# EAGLE design gl-main (EAGLE 6.4)
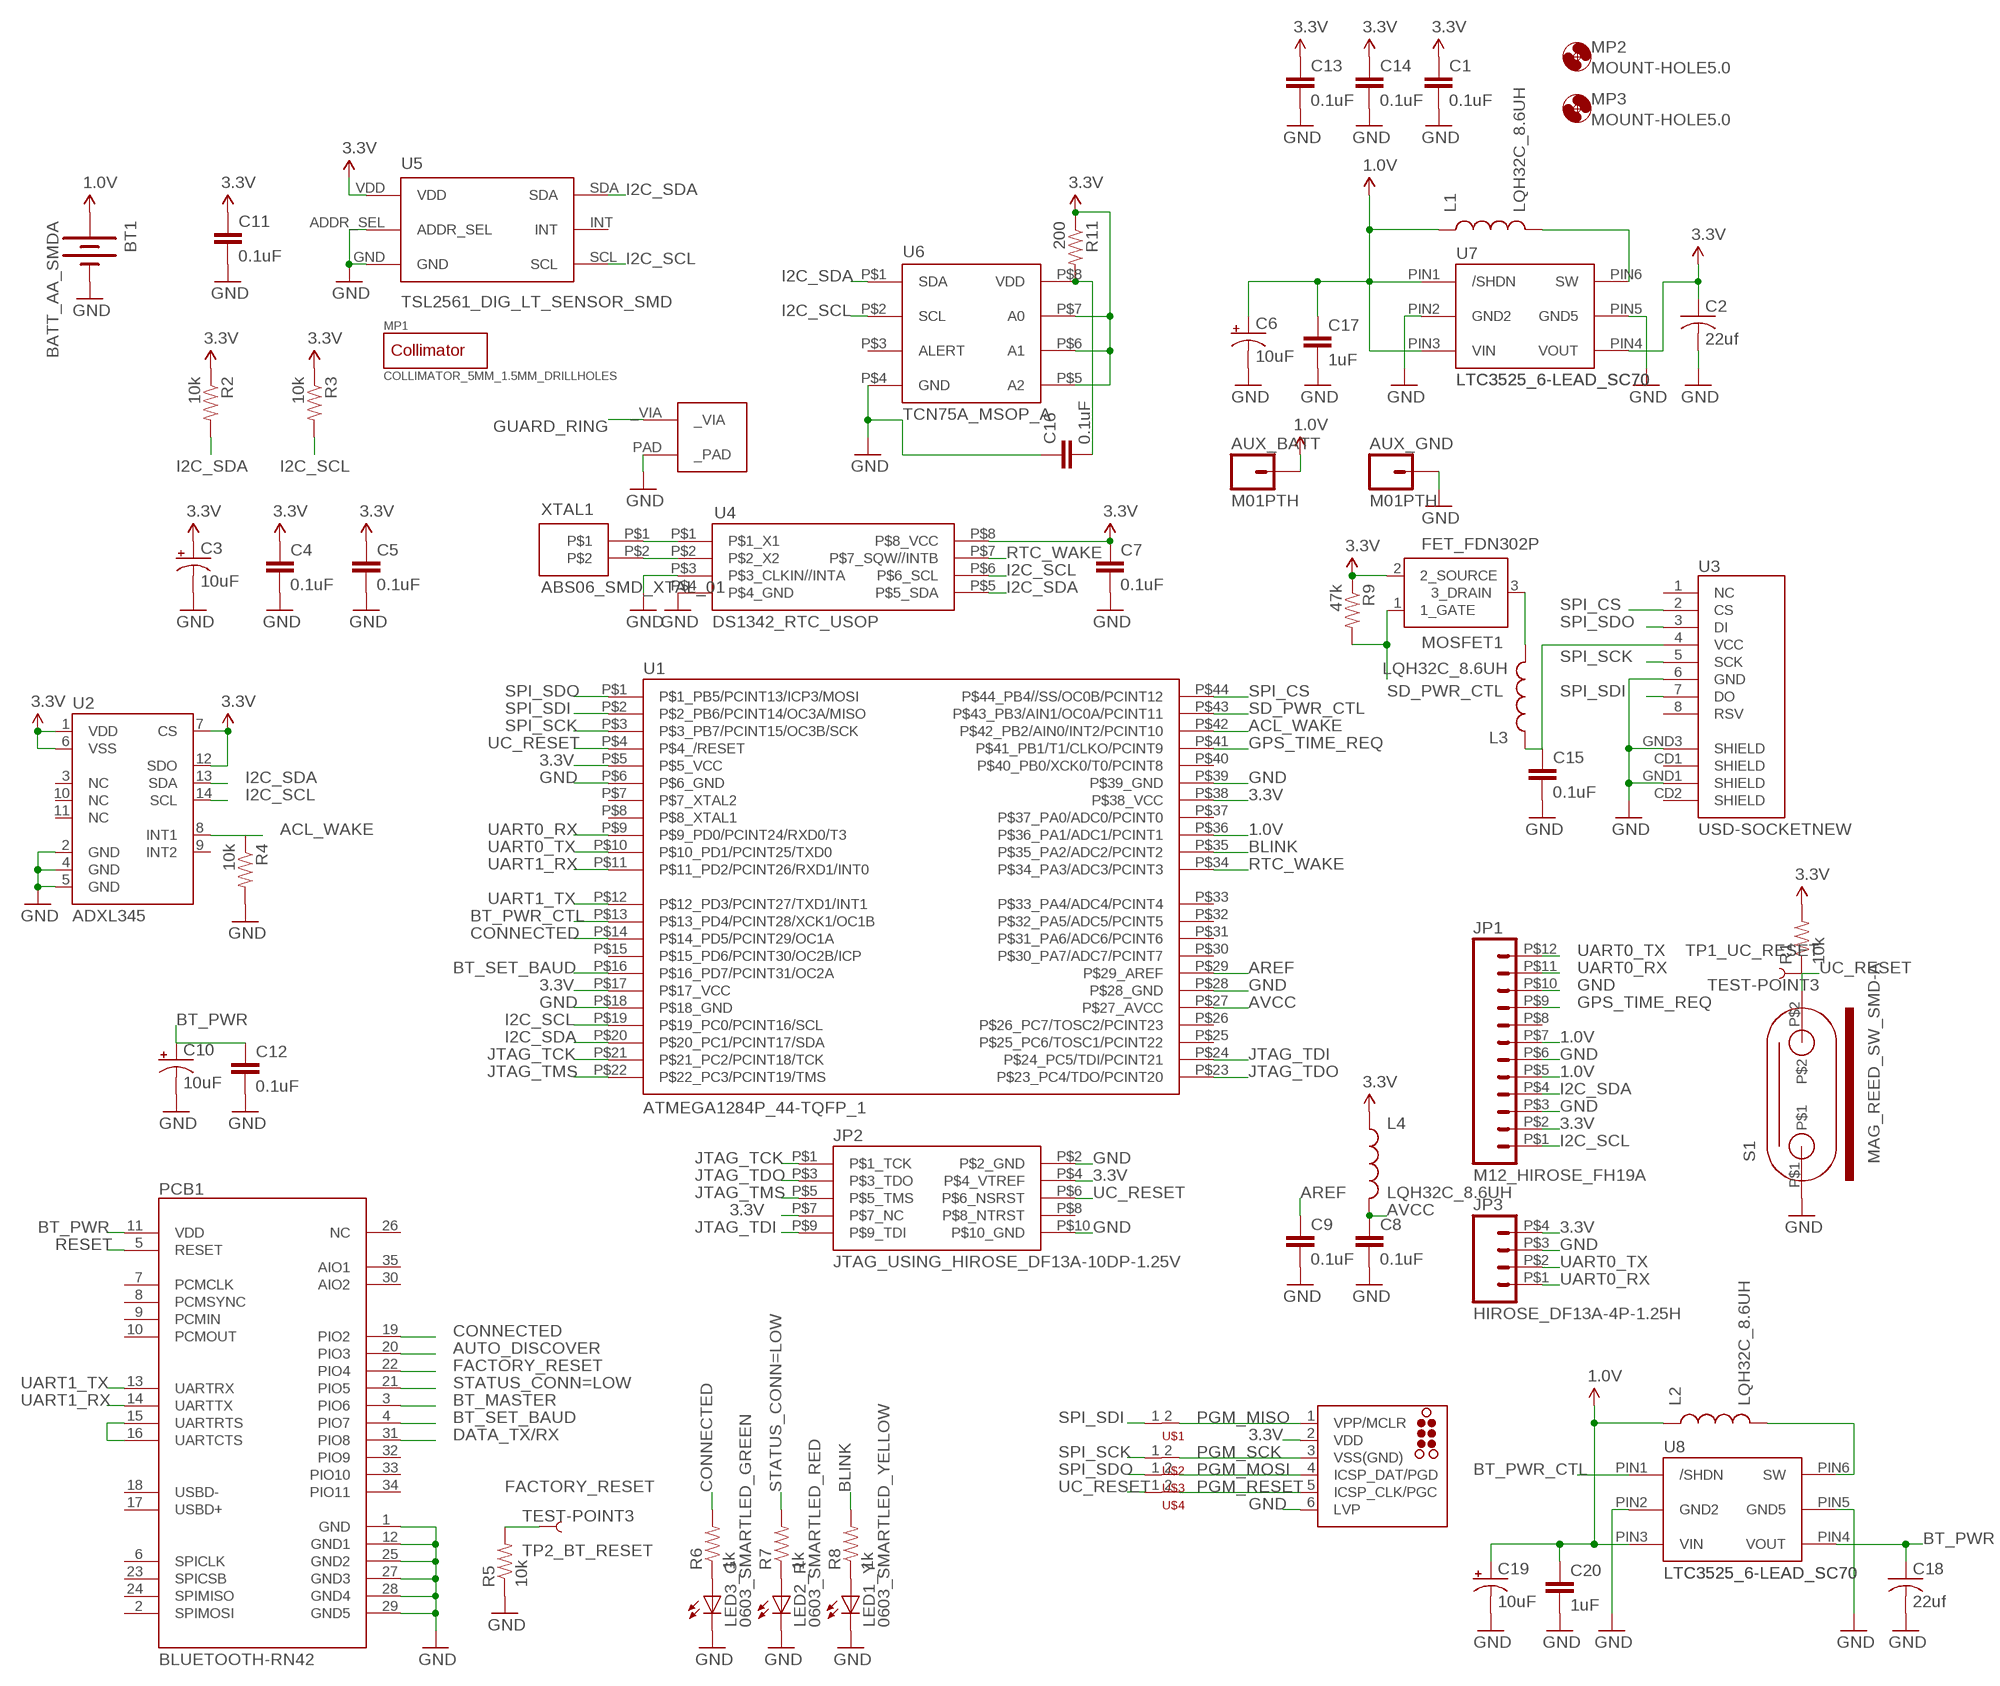
[diagram p0: schematic, sheet 1]

## Parts
AUX_BATT  M01PTH  [1X01]
AUX_GND  M01PTH  [1X01]
BT1  BATT_AA_SMDA  [BATT_AA_SMD]
C1  0.1uF  CAP0402-CAP  [0402-CAP]
C2  22uf  C-USC1210K  [C1210K]
C3  10uF  CAP_POL1206  [EIA3216]
C4  0.1uF  CAP0402-CAP  [0402-CAP]
C5  0.1uF  CAP0402-CAP  [0402-CAP]
C6  10uF  CAP_POL1206  [EIA3216]
C7  0.1uF  CAP0402-CAP  [0402-CAP]
C8  0.1uF  CAP0402-CAP  [0402-CAP]
C9  0.1uF  CAP0402-CAP  [0402-CAP]
C10  10uF  CAP_POL1206  [EIA3216]
C11  0.1uF  CAP0402-CAP  [0402-CAP]
C12  0.1uF  CAP0402-CAP  [0402-CAP]
C13  0.1uF  CAP0402-CAP  [0402-CAP]
C14  0.1uF  CAP0402-CAP  [0402-CAP]
C15  0.1uF  CAP0402-CAP  [0402-CAP]
C16  0.1uF  CAP0402-CAP  [0402-CAP]
C17  1uF  CAP0603-CAP  [0603-CAP]
C18  22uf  C-USC1210K  [C1210K]
C19  10uF  CAP_POL1206  [EIA3216]
C20  1uF  CAP0603-CAP  [0603-CAP]
J1  TC2030-MCP-NL  [TC2030-MCP-NL]
JP1  M12_HIROSE_FH19A  [HIROSE_FH19_12POS]
JP2  JTAG_USING_HIROSE_DF13A-10DP-1.25V  [10PIN_MALE_HDR_DBL-ROW_HIROSE_D13]
JP3  HIROSE_DF13A-4P-1.25H  [HIROSE_DF13A-4P-1.25H]
L1  LQH32C_8.6UH  LQH32C  [1210_SIZE_INDUCTOR]
L2  LQH32C_8.6UH  LQH32C  [1210_SIZE_INDUCTOR]
L3  LQH32C_8.6UH  LQH32C  [1210_SIZE_INDUCTOR]
L4  LQH32C_8.6UH  LQH32C  [1210_SIZE_INDUCTOR]
LED1_Y  0603_SMARTLED_YELLOW  0603_SMARTLED  [0603_SMARTLED]
LED2_R  0603_SMARTLED_RED  0603_SMARTLED  [0603_SMARTLED]
LED3_G  0603_SMARTLED_GREEN  0603_SMARTLED  [0603_SMARTLED]
MOSFET1  FET_FDN302P  [SUPERSOT-3]
MP1  COLLIMATOR_5MM_1.5MM_DRILLHOLES  [COLLIMATOR_5MM_1.5MM_DRILLHOLES]
MP2  MOUNT-HOLE5.0  [5,0]
MP3  MOUNT-HOLE5.0  [5,0]
PCB1  BLUETOOTH-RN42  BLUETOOTH-RN41"  [RN41]
R1  10k  RESISTOR0402-RES  [0402-RES]
R2  10k  RESISTOR0402-RES  [0402-RES]
R3  10k  RESISTOR0402-RES  [0402-RES]
R4  10k  RESISTOR0402-RES  [0402-RES]
R5  10k  RESISTOR0402-RES  [0402-RES]
R6  1k  RESISTOR0402-RES  [0402-RES]
R7  1k  RESISTOR0402-RES  [0402-RES]
R8  1k  RESISTOR0402-RES  [0402-RES]
R9  47k  RESISTOR0402-RES  [0402-RES]
R11  200  RESISTOR0402-RES  [0402-RES]
S1  MAG_REED_SW_SMD-A  [MAG_REED_SW_SMD_GULL-WING]
TP1_UC_RESET  TEST-POINT3  [PAD.03X.03]
TP2_BT_RESET  TEST-POINT3  [PAD.03X.03]
U1  ATMEGA1284P_44-TQFP_1  [44-TQFP]
U2  ADXL345  [LGA14]
U3  USD-SOCKETNEW  [MICRO-SD-SOCKET-PP]
U4  DS1342_RTC_USOP  [8-MICROMAX]
U5  TSL2561_DIG_LT_SENSOR_SMD  [6_PAD_FLAT_NO-LEAD]
U6  TCN75A_MSOP_A  [MSOP-8]
U7  LTC3525_6-LEAD_SC70  [SC70]
U8  LTC3525_6-LEAD_SC70  [SC70]
U$1  SHORT_8MIL8MIL  [SHORT_8MIL]
U$2  SHORT_8MIL8MIL  [SHORT_8MIL]
U$3  SHORT_8MIL8MIL  [SHORT_8MIL]
U$4  SHORT_8MIL8MIL  [SHORT_8MIL]
W1  2-SIGNAL_VIA_AND_PAD_01  [2_SIGNALS_VIA_AND_PAD]
XTAL1  ABS06_SMD_XTAL_01  [ABS06]

## Nets
1.0V: AUX_BATT.1 BT1.P$1(+) C6.A(+) C17.1 C19.A(+) C20.1 JP1.P$5 JP1.P$7 L1.P$1 L2.P$1 U1.P$36(P$36_PA1/ADC1/PCINT1) U7.PIN1(/SHDN) U7.PIN3(VIN) U8.PIN3(VIN)
3.3V: C1.1 C2.1 C3.A(+) C4.1 C5.1 C7.1 C11.1 C13.1 C14.1 J1.2(VDD) JP1.P$2 JP2.P$4(P$4_VTREF) JP2.P$7(P$7_NC) JP3.P$4 L4.P$1 MOSFET1.2(2_SOURCE) R1.2 R2.1 R3.1 R9.1 R11.1 U1.P$5(P$5_VCC) U1.P$17(P$17_VCC) U1.P$38(P$38_VCC) U2.1(VDD) U2.6(VSS) U2.7(CS) U2.12(SDO) U4.P$8(P$8_VCC) U5.VDD U6.P$5(A2) U6.P$6(A1) U6.P$7(A0) U7.PIN4(VOUT)
ACL_WAKE: R4.1 U1.P$42(P$42_PB2/AIN0/INT2/PCINT10) U2.8(INT1)
AREF: C9.1 U1.P$29(P$29_AREF)
AUTO_DISCOVER: PCB1.20(PIO3)
AVCC: C8.1 L4.P$2 U1.P$27(P$27_AVCC)
BLINK: R8.2 U1.P$35(P$35_PA2/ADC2/PCINT2)
BT_MASTER: PCB1.3(PIO6)
BT_PWR: C10.A(+) C12.1 C18.1 PCB1.11(VDD) U8.PIN4(VOUT)
BT_PWR_CTL: U1.P$13(P$13_PD4/PCINT28/XCK1/OC1B) U8.PIN1(/SHDN)
BT_SET_BAUD: PCB1.4(PIO7) U1.P$16(P$16_PD7/PCINT31/OC2A)
CONNECTED: PCB1.19(PIO2) R6.2 U1.P$14(P$14_PD5/PCINT29/OC1A)
DATA_TX/RX: PCB1.31(PIO8)
FACTORY_RESET: PCB1.22(PIO4) R5.2 TP2_BT_RESET.P$1
GND: AUX_GND.1 BT1.P$2(-) C1.2 C2.2 C3.C(-) C4.2 C5.2 C6.C(-) C7.2 C8.2 C9.2 C10.C(-) C11.2 C12.2 C13.2 C14.2 C15.2 C16.1 C17.2 C18.2 C19.C(-) C20.2 J1.6(LVP) JP1.P$3 JP1.P$6 JP1.P$10 JP2.P$2(P$2_GND) JP2.P$10(P$10_GND) JP3.P$3 LED1_Y.P$1(C) LED2_R.P$1(C) LED3_G.P$1(C) PCB1.1(GND) PCB1.12(GND1) PCB1.25(GND2) PCB1.27(GND3) PCB1.28(GND4) PCB1.29(GND5) R4.2 R5.1 S1.P$1 U1.P$6(P$6_GND) U1.P$18(P$18_GND) U1.P$28(P$28_GND) U1.P$39(P$39_GND) U2.2(GND) U2.4(GND) U2.5(GND) U3.6(GND) U3.GND1(SHIELD) U3.GND3(SHIELD) U4.P$3(P$3_CLKIN//INTA) U4.P$4(P$4_GND) U5.ADDR_SEL U5.GND U6.P$4(GND) U7.PIN2(GND2) U7.PIN5(GND5) U8.PIN2(GND2) U8.PIN5(GND5) W1.PAD(_PAD)
GPS_TIME_REQ: JP1.P$9 U1.P$41(P$41_PB1/T1/CLKO/PCINT9)
GUARD_RING: W1._VIA
I2C_SCL: JP1.P$1 R3.2 U1.P$19(P$19_PC0/PCINT16/SCL) U2.14(SCL) U4.P$6(P$6_SCL) U5.SCL U6.P$2(SCL)
I2C_SDA: JP1.P$4 R2.2 U1.P$20(P$20_PC1/PCINT17/SDA) U2.13(SDA) U4.P$5(P$5_SDA) U5.SDA U6.P$1(SDA)
JTAG_TCK: JP2.P$1(P$1_TCK) U1.P$21(P$21_PC2/PCINT18/TCK)
JTAG_TDI: JP2.P$9(P$9_TDI) U1.P$24(P$24_PC5/TDI/PCINT21)
JTAG_TDO: JP2.P$3(P$3_TDO) U1.P$23(P$23_PC4/TDO/PCINT20)
JTAG_TMS: JP2.P$5(P$5_TMS) U1.P$22(P$22_PC3/PCINT19/TMS)
N$1: LED1_Y.P$2(A) R8.1
N$2: L1.P$2 U7.PIN6(SW)
N$3: C15.1 L3.P$1 U3.4(VCC)
N$4: L3.P$2 MOSFET1.3(3_DRAIN)
N$5: PCB1.15(UARTRTS) PCB1.16(UARTCTS)
N$7: LED2_R.P$2(A) R7.1
N$8: LED3_G.P$2(A) R6.1
N$11: C16.2 R11.2 U6.P$8(VDD)
N$12: L2.P$2 U8.PIN6(SW)
N$13: U4.P$1(P$1_X1) XTAL1.P$1
N$14: U4.P$2(P$2_X2) XTAL1.P$2
PGM_MISO: J1.1(VPP/MCLR) U$1.2(P)
PGM_MOSI: J1.4(ICSP_DAT/PGD) U$3.2(P)
PGM_RESET: J1.5(ICSP_CLK/PGC) U$4.2(P)
PGM_SCK: J1.3(VSS(GND)) U$2.2(P)
RESET: PCB1.5(RESET)
RTC_WAKE: U1.P$34(P$34_PA3/ADC3/PCINT3) U4.P$7(P$7_SQW//INTB)
SD_PWR_CTL: MOSFET1.1(1_GATE) R9.2 U1.P$43(P$43_PB3/AIN1/OC0A/PCINT11)
SPI_CS: U1.P$44(P$44_PB4//SS/OC0B/PCINT12) U3.2(CS)
SPI_SCK: U1.P$3(P$3_PB7/PCINT15/OC3B/SCK) U3.5(SCK) U$2.1(P)
SPI_SDI: U1.P$2(P$2_PB6/PCINT14/OC3A/MISO) U3.7(DO) U$1.1(P)
SPI_SDO: U1.P$1(P$1_PB5/PCINT13/ICP3/MOSI) U3.3(DI) U$3.1(P)
STATUS_CONN=LOW: PCB1.21(PIO5) R7.2
UART0_RX: JP1.P$11 JP3.P$1 U1.P$9(P$9_PD0/PCINT24/RXD0/T3)
UART0_TX: JP1.P$12 JP3.P$2 U1.P$10(P$10_PD1/PCINT25/TXD0)
UART1_RX: PCB1.14(UARTTX) U1.P$11(P$11_PD2/PCINT26/RXD1/INT0)
UART1_TX: PCB1.13(UARTRX) U1.P$12(P$12_PD3/PCINT27/TXD1/INT1)
UC_RESET: JP2.P$6(P$6_NSRST) R1.1 S1.P$2 TP1_UC_RESET.P$1 U1.P$4(P$4_/RESET) U$4.1(P)
Unconnected: JP1.P$8 JP2.P$8(P$8_NTRST) PCB1.2(SPIMOSI) PCB1.6(SPICLK) PCB1.7(PCMCLK) PCB1.8(PCMSYNC) PCB1.9(PCMIN) PCB1.10(PCMOUT) PCB1.17(USBD+) PCB1.18(USBD-) PCB1.23(SPICSB) PCB1.24(SPIMISO) PCB1.26(NC) PCB1.30(AIO2) PCB1.32(PIO9) PCB1.33(PIO10) PCB1.34(PIO11) PCB1.35(AIO1) U1.P$7(P$7_XTAL2) U1.P$8(P$8_XTAL1) U1.P$15(P$15_PD6/PCINT30/OC2B/ICP) U1.P$25(P$25_PC6/TOSC1/PCINT22) U1.P$26(P$26_PC7/TOSC2/PCINT23) U1.P$30(P$30_PA7/ADC7/PCINT7) U1.P$31(P$31_PA6/ADC6/PCINT6) U1.P$32(P$32_PA5/ADC5/PCINT5) U1.P$33(P$33_PA4/ADC4/PCINT4) U1.P$37(P$37_PA0/ADC0/PCINT0) U1.P$40(P$40_PB0/XCK0/T0/PCINT8) U2.3(NC) U2.9(INT2) U2.10(NC) U2.11(NC) U3.1(NC) U3.8(RSV) U3.CD1(SHIELD) U3.CD2(SHIELD) U5.INT U6.P$3(ALERT)

## Library data of the parts
AUX_BATT AUX_GND = SparkFun:M01: Header 1 Standard 1-pin 0.1" header. Use with straight break away headers (SKU : PRT-00116), right angle break away headers (PRT-00553), swiss pins (PRT-00743), machine pins (PRT-00117), and female headers (PRT-00115).
BT1 = rshory:BATT_AA_SMD: Surface mount battery holder for single AA size cell. Keystone Electronics part number 1024.
C1 C4 C5 C7-C9 C11-C17 C20 = SparkFun:CAP: Capacitor Standard 0603 ceramic capacitor, and 0.1" leaded capacitor.
C2 C18 = resistor:C-US: CAPACITOR, American symbol
C3 C6 C10 C19 = SparkFun:CAP_POL: Capacitor Polarized These are standard SMD and PTH capacitors. Normally 10uF, 47uF, and 100uF in electrolytic and tantalum varieties. Always verify the external diameter of the through hole cap, it varies with capacity, voltage, and manufacturer. The EIA devices should be standard.
J1 = tag-connect:TC2030: TAG-CONNECT ICSP Connector Manufacturer: Tag-Connect <http://www.tag-connect.com> Cable for easy In-Circuit Serial Programming. Designed for Microchip ICD2, suitable for many others. Two variants - one "with legs" (for hands-free fit on PCB) and another "without legs" for quick programming. PAD Description 1 MCLR/Vpp 2 Vdd 3 GND 4 PGD (ISPDAT) 5 PGC (ISPCLK) 6 nc (used for LVP) ©2009 ROFA.cz - modified and updated by Robert Darlington ‹rdarlington@gmail.com›
JP1 = rshoryV6:M12_HIROSE_FH19: Surface mount connector for flat flex cable (FFC), 12 position, 0.5mm pitch, Hirose FH19 series
JP2 = rshory:JTAG_USING_HIROSE_DF13A-10DP-1.25V: Hirose DF13A-10DP-1.25V, with pins specified to serve as a standard 10-pin JTAG header. This part is surface mount and has 1.25mm pitch.
JP3 = rshory:HIROSE_DF13A-4P-1.25H: Hirose DF13A- 4P-1.25H pin header, 4 position, 90 degree, surface mount.
L1-L4 = rshory:LQH32C: LQH32C_53 Series chip inductor, smd 1210 size
LED1_Y LED2_R LED3_G = rshory:0603_SMARTLED: SmartLED, 0603 footprint, Osram. Diagonal silkscreen mark indicates cathode, matches cutout on case.
MOSFET1 = rshory:FET_FDN302P: P-channel enhancement mode MOSFET
MP1 = rshory:COLLIMATOR_5MM_1.5MM_DRILLHOLES: Collimator, put over a photodetector to limit incoming light to a certain range of angle. Pieces to be laser-cut out of standard black acrylic sheet, 3/16" (~5mm) thickness. Center hole is 5mm diameter. Drill holes in the board are 1.5mm diameter, for screws to tap into. This is the best hole to take size 0-43 thread forming screws (McMaster part number 95893A119). LaserCuts layer (108) shows traces for laser cutting, about 0.25mm, 10mils kerf. So hole radii are half this much smaller, outside dimensions are half this much larger. Note that screw holes in the piece (nominal 1.8mm) are larger than the board holes. Screws go cleanly THROUGH the piece holes, but CUT INTO board holes. Approximate size of screw heads are on the tDocu layer.
MP2 MP3 = holes:MOUNT-HOLE: MOUNTING HOLE with drill center marker
PCB1 = SparkFun:BLUETOOTH-RN41
R1-R9 R11 = SparkFun:RESISTOR: Resistor Basic schematic elements and footprints for 0603, 1206, and PTH resistors.
S1 = rshory:MAG_REED_SW_SMD: Magnetic reed switch, SPST, SMD, gull-wing leads, Hamlin part #59165-1-S-00-C
TP1_UC_RESET TP2_BT_RESET = SparkFun:TEST-POINT
U1 = rshory:ATMEGA1284P_44-TQFP: AVR ATmega1248P microcontroller, 0.8 mm Lead Pitch, Thin Profile Plastic Quad Flat Package (TQFP)
U2 = SparkFun:ADXL345
U3 = SparkFun:USD-SOCKET: microSD Socket Push-push type uSD socket. Schematic element and footprint production proven. Spark Fun Electronics SKU : PRT-00127. tDoc lines correctly indicate media card edge positions when inserting (unlocked, locked, depressed).
U4 = rshory:DS1342_RTC_USOP: DS1342 real-time clock, microSOP (micromax) package which is 3mm square. Uses a standard 32.768kHz crystal with load capacitance of 12.5pF. The DS1341 is the same except it uses a crystal with load capacitance of 6pF. The 6pF crystals use slightly less power, but more choices of 12.5pF crystals are available.
U5 = rshoryV6:TSL2561_DIG_LT_SENSOR: TAOS infrared and broadband digital light sensor, I2C interface
U6 = rshory:TCN75A_MSOP: Temperature sensor in MSOP package. I2C interface. Selectable address. Microchip TCN75A.
U7 U8 = rshoryV6:LTC3525: LTC2525 3.3v boost regulator 6-lead SC70 package
U$1-U$4 = rshoryV6:SHORT_8MIL
W1 = rshory2:2-SIGNAL_VIA_AND_PAD
XTAL1 = rshory:ABS06_SMD_XTAL

## Board
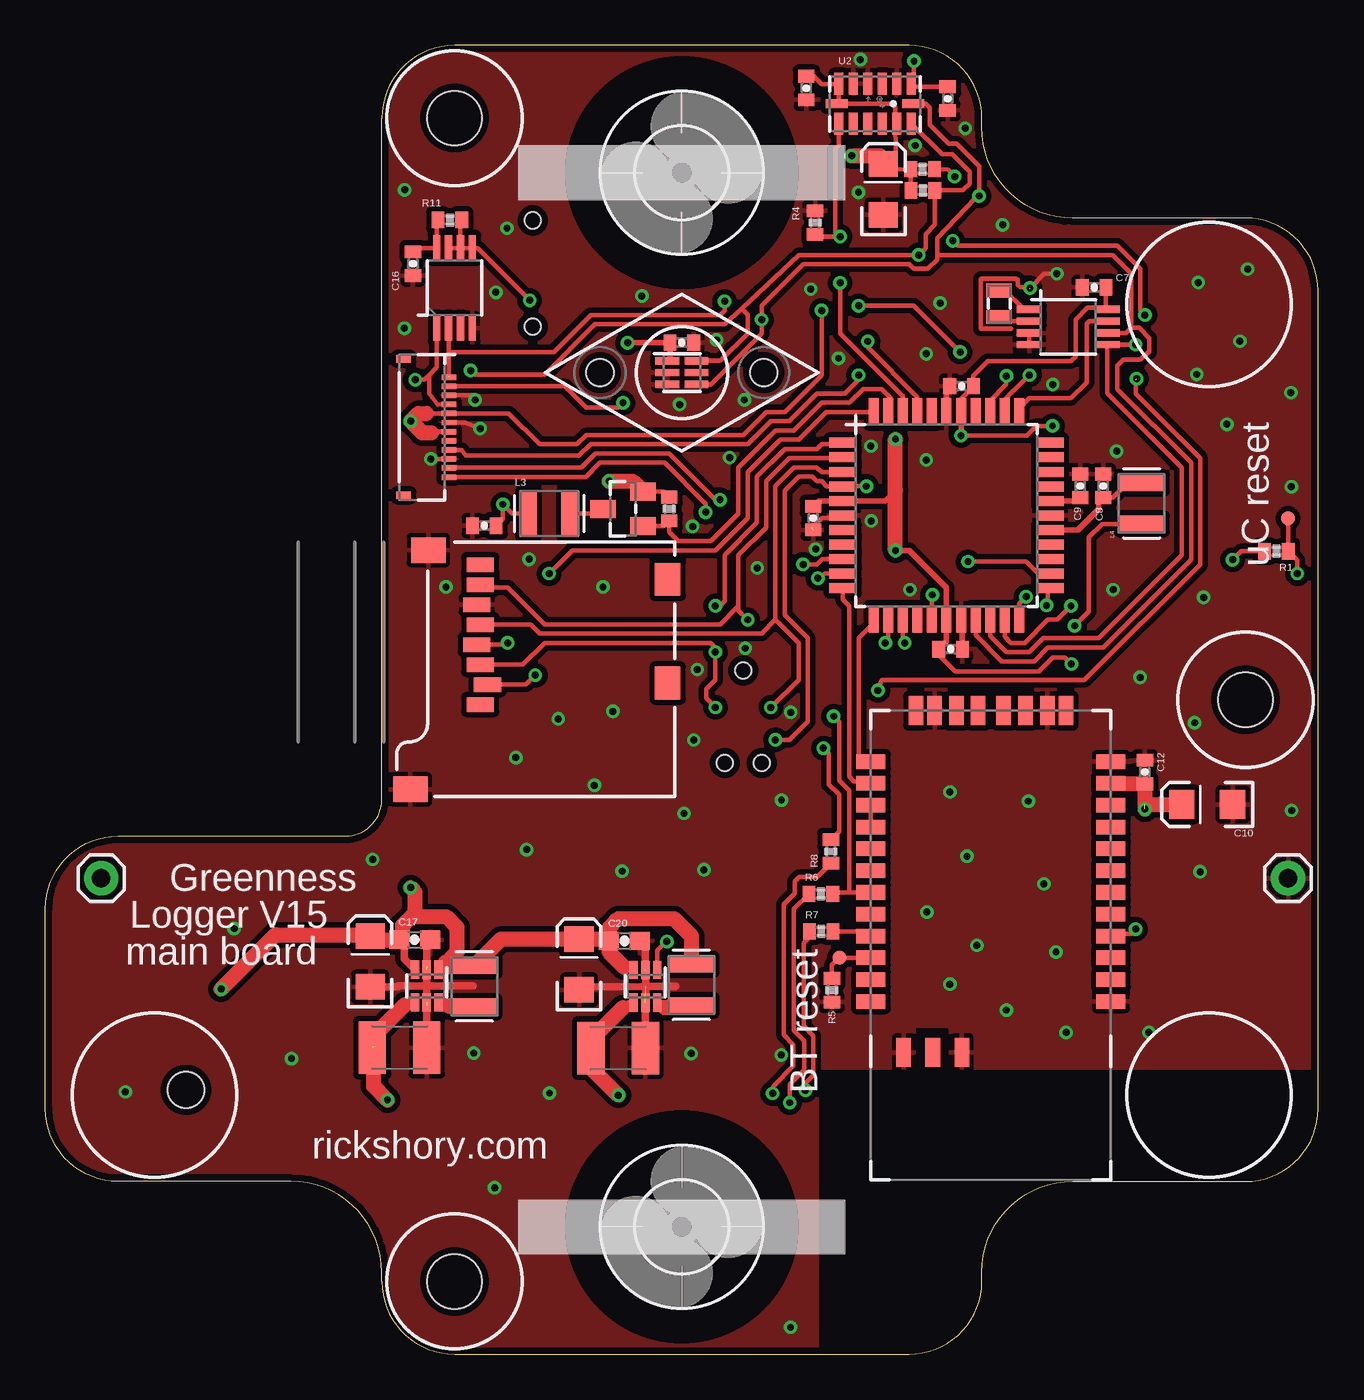
[diagram p1: board, top side]
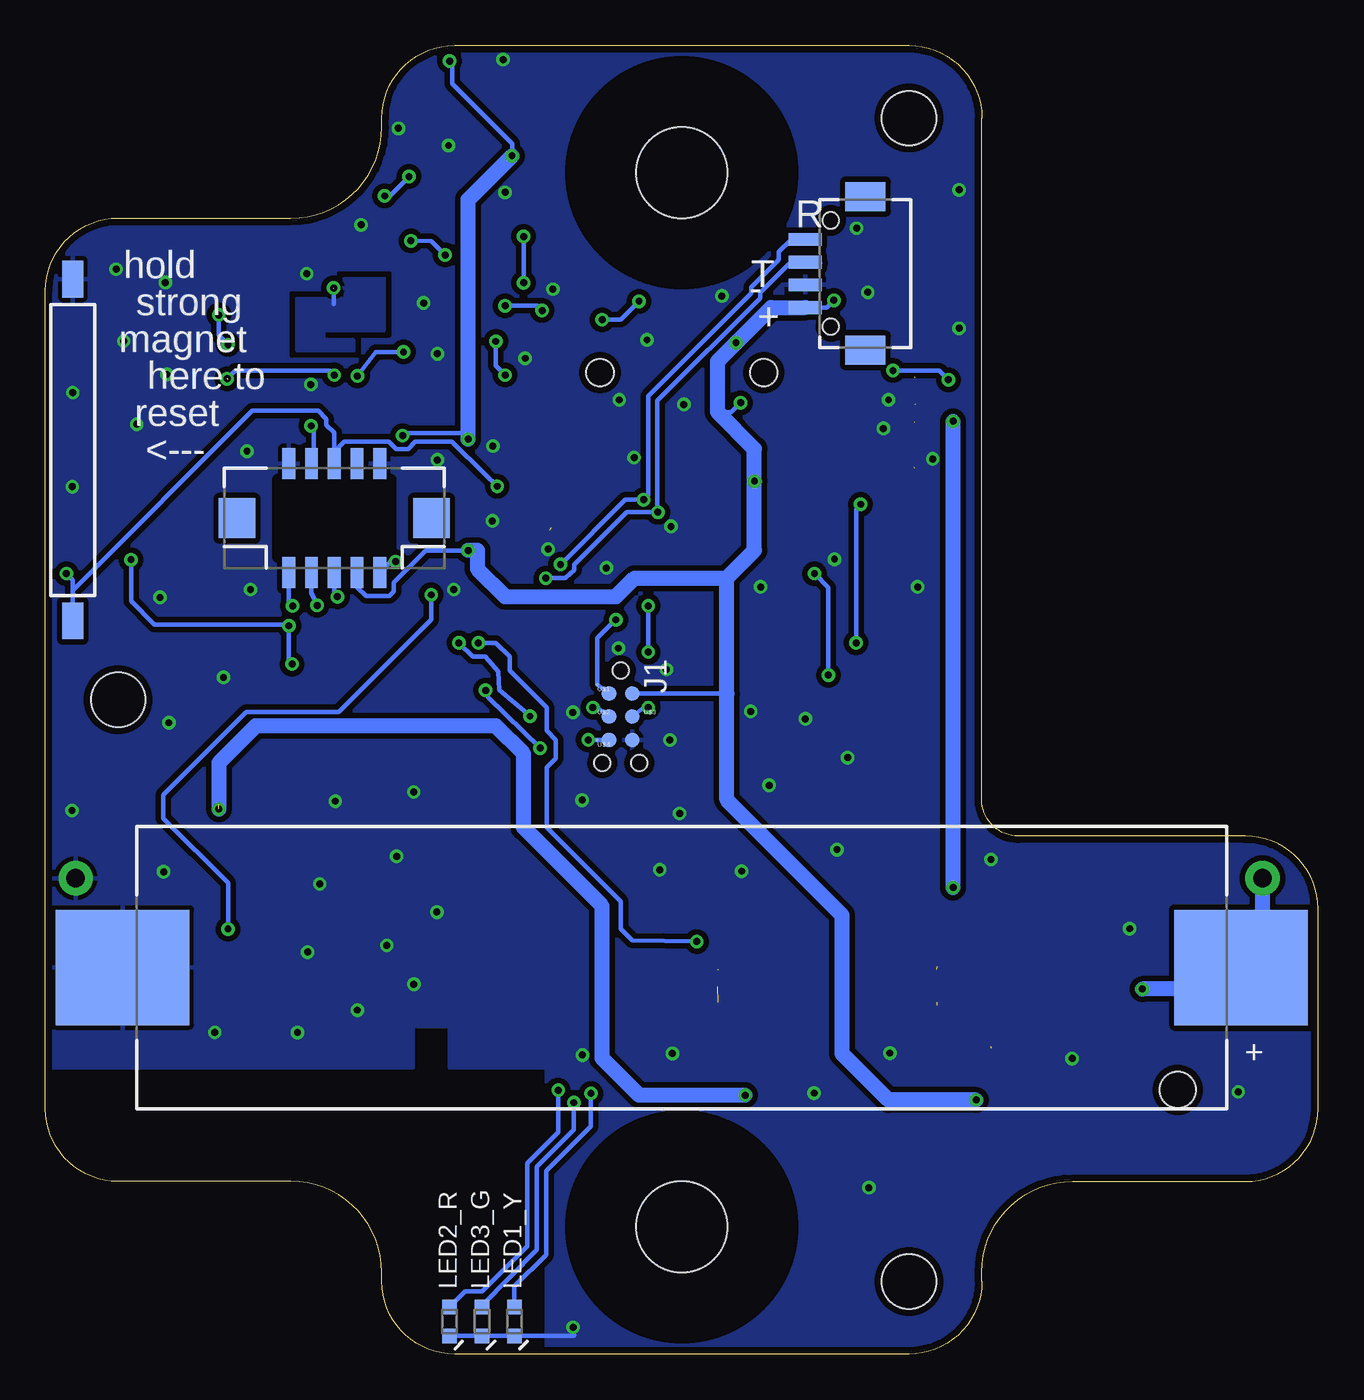
[diagram p2: board, bottom side, seen from below]

Size 70 x 72 mm. Coordinates in mm from the lower left corner, seen from the top.
Outline: 18.5,4 arc90 22.5,0 47.5,0 arc90 51.5,4 51.5,4.5 arc-90 56.5,9.5 66,9.5 arc90 70,13.5 70,58.5 arc90 66,62.5 56.5,62.5 arc-90 51.5,67.5 51.5,68 arc90 47.5,72 22.5,72 arc90 18.5,68 18.5,30.5 arc-90 16.5,28.5 4,28.5 arc90 0,24.5 0,13.5 arc90 4,9.5 13.5,9.5 arc-90 18.5,4.5 18.5,4
Copper layers (1*16): Top 0.0356mm / dielectric 1.5011mm / Bottom 0.0356mm
Design rules "default": minimum track width 6mil, minimum drill 13mil, track to track 6mil, track to pad 6mil, pad to pad 6mil, via to via 6mil, smd to smd 6mil, copper to edge 15mil, drill to drill 6mil, minimum pad ring 7mil, minimum via ring 7mil, stop-mask expansion 4mil, vias tented up to drill 16mil, thermal gap 10mil
Holes 3 mm at 22.5,4 22.5,68 66,36

### Footprints (pad centres in the part's own frame; a part is rotated, then mirrored left to right if it is on the bottom)
1X01 = drill 1.016 pad 1.88: 1 0,0
BATT_AA_SMD = smd 7.34 x 6.35: P$1 -30.76,0; P$2 30.76,0 | hole 2: -27.27,6.73
0402-CAP = smd 0.7 x 0.9: 1 -0.65,0; 2 0.65,0
C1210K = smd 1.5 x 2.9: 1 -1.5,0; 2 1.5,0
EIA3216 = smd 1.4 x 1.6: A 1.4,0; C -1.4,0
0603-CAP = smd 1.1 x 1: 1 -0.85,0; 2 0.85,0
TC2030-MCP-NL = smd 0.787 x 0.787: 1 1.27,-0.635; 2 1.27,0.635; 3 2.54,-0.635; 4 2.54,0.635; 5 3.81,-0.635; 6 3.81,0.635 | hole 0.889: 0,0; 5.08,-1.016; 5.08,1.016
HIROSE_FH19_12POS = smd 0.3 x 0.8: P$1 -2.75,1.2; P$2 -2.25,1.2; P$3 -1.75,1.2; P$4 -1.25,1.2; P$5 -0.75,1.2; P$6 -0.25,1.2; P$7 0.25,1.2; P$8 0.75,1.2; P$9 1.25,1.2; P$10 1.75,1.2; P$11 2.25,1.2; P$12 2.75,1.2 | smd 0.4 x 0.8: P$13 3.75,-1.3; P$14 -3.75,-1.3
10PIN_MALE_HDR_DBL-ROW_HIROSE_D13 = smd 1.7 x 0.7: P$1 -3,2.5; P$2 3,2.5; P$3 -3,1.25; P$4 3,1.25; P$5 -3,0; P$6 3,0; P$7 -3,-1.25; P$8 3,-1.25; P$9 -3,-2.5; P$10 3,-2.5 | smd 2.2 x 2: P$11 0,5.35; P$12 0,-5.35
HIROSE_DF13A-4P-1.25H = smd 0.7 x 1.8: P$1 -1.875,-3.3; P$2 -0.625,-3.3; P$3 0.625,-3.3; P$4 1.875,-3.3 | smd 1.6 x 2.2: P$5 4.225,0; P$6 -4.225,0 | hole 0.9: -2.925,-1.9; 2.925,-1.9
1210_SIZE_INDUCTOR = smd 0.9 x 2.5: P$1 -1.125,0; P$2 1.125,0
0603_SMARTLED = smd 0.8 x 0.8: P$1 -0.8,0; P$2 0.8,0
SUPERSOT-3 = smd 1 x 1.4: 1 -0.95,-1.1; 2 0.95,-1.1; 3 0,1.1
COLLIMATOR_5MM_1.5MM_DRILLHOLES = hole 1.5: -4.5,0; 4.5,0
5,0 = hole 5: 0,0
RN41 = smd 0.8 x 1.6: 1 -6.6,-6.6; 2 -5.4,-6.6; 3 -4.2,-6.6; 4 -3,-6.6; 5 -1.8,-6.6; 6 -0.6,-6.6; 7 0.6,-6.6; 8 1.8,-6.6; 9 3,-6.6; 10 4.2,-6.6; 11 5.4,-6.6; 12 6.6,-6.6; 13 6.6,6.6; 14 5.4,6.6; 15 4.2,6.6; 16 3,6.6; 17 1.8,6.6; 18 0.6,6.6; 19 -0.6,6.6; 20 -1.8,6.6; 21 -3,6.6; 22 -4.2,6.6; 23 -5.4,6.6; 24 -6.6,6.6 | smd 1.6 x 0.8: 25 -9.4,4.8; 26 -9.4,3.2; 27 -9.4,1.6; 28 9.4,3.1; 29 9.4,-3.1; 30 9.4,-4.122; 31 9.4,-1.9; 32 9.4,-0.7; 33 9.4,0.7; 34 9.4,1.9; 35 9.4,4.122
0402-RES = smd 0.7 x 0.9: 1 -0.65,0; 2 0.65,0
MAG_REED_SW_SMD_GULL-WING = smd 2.03 x 1.14: P$1 -9.4,0; P$2 9.4,0
PAD.03X.03 = smd 0.762 x 0.762: P$1 0,0
44-TQFP = smd 1.5 x 0.55: P$1 -5.7,4; P$2 -5.7,3.2; P$3 -5.7,2.4; P$4 -5.7,1.6; P$5 -5.7,0.8; P$6 -5.7,0; P$7 -5.7,-0.8; P$8 -5.7,-1.6; P$9 -5.7,-2.4; P$10 -5.7,-3.2; P$11 -5.7,-4; P$23 5.7,-4; P$24 5.7,-3.2; P$25 5.7,-2.4; P$26 5.7,-1.6; P$27 5.7,-0.8; P$28 5.7,0; P$29 5.7,0.8; P$30 5.7,1.6; P$31 5.7,2.4; P$32 5.7,3.2; P$33 5.7,4 | smd 0.55 x 1.5: P$12 -4,-5.7; P$13 -3.2,-5.7; P$14 -2.4,-5.7; P$15 -1.6,-5.7; P$16 -0.8,-5.7; P$17 0,-5.7; P$18 0.8,-5.7; P$19 1.6,-5.7; P$20 2.4,-5.7; P$21 3.2,-5.7; P$22 4,-5.7; P$34 4,5.7; P$35 3.2,5.7; P$36 2.4,5.7; P$37 1.6,5.7; P$38 0.8,5.7; P$39 0,5.7; P$40 -0.8,5.7; P$41 -1.6,5.7; P$42 -2.4,5.7; P$43 -3.2,5.7; P$44 -4,5.7
LGA14 = smd 0.5 x 1.2: 1 2,1.1; 2 1.2,1.1; 3 0.4,1.1; 4 -0.4,1.1; 5 -1.2,1.1; 6 -2,1.1; 8 -2,-1.1; 9 -1.2,-1.1; 10 -0.4,-1.1; 11 0.4,-1.1; 12 1.2,-1.1; 13 2,-1.1 | smd 1.2 x 0.5: 7 -2.1,0; 14 2.1,0
MICRO-SD-SOCKET-PP = smd 0.8 x 1.5: 1 -8.94,10.7; 2 -7.84,10.3; 3 -6.74,10.7; 4 -5.64,10.9; 5 -4.54,10.7; 6 -3.44,10.9; 7 -2.34,10.7; 8 -1.24,10.7 | smd 1.8 x 1.4: CD1 -2.05,0.4; CD2 -7.75,0.4 | smd 1.4 x 1.9: GND1 -13.6,14.55; GND3 -0.45,13.55
8-MICROMAX = smd 1.35 x 0.4: P$1 -2.15,0.975; P$2 -2.15,0.325; P$3 -2.15,-0.325; P$4 -2.15,-0.975; P$5 2.15,-0.975; P$6 2.15,-0.325; P$7 2.15,0.325; P$8 2.15,0.975
6_PAD_FLAT_NO-LEAD = smd 1.3 x 0.4: ADDR_SEL -0.8,0; GND -0.8,-0.65; INT 0.8,0; SCL 0.8,-0.65; SDA 0.8,0.65; VDD -0.8,0.65
MSOP-8 = smd 0.4 x 1.4: P$1 -0.975,-2.2; P$2 -0.325,-2.2; P$3 0.325,-2.2; P$4 0.975,-2.2; P$5 0.975,2.2; P$6 0.325,2.2; P$7 -0.325,2.2; P$8 -0.975,2.2
SC70 = smd 1 x 0.46: PIN1 -0.9,0.65; PIN2 -0.9,0; PIN3 -0.9,-0.65; PIN4 0.9,-0.65; PIN5 0.9,0; PIN6 0.9,0.65
SHORT_8MIL = smd 0.203 x 0.203: 1 0,0; 2 0,0
2_SIGNALS_VIA_AND_PAD = drill 0.381: _VIA 0,0 | smd 0.762 x 0.762: PAD 0,0
ABS06 = smd 0.75 x 1.4: P$1 -0.725,0; P$2 0.725,0

### Placement (x,y rotation side)
AUX_BATT  3.06,26.18 0 top
AUX_GND  68.34,26.18 0 top
BT1  35,21.27 180 bottom
C1  50.38,53.25 180 top
C2  19.48,16.86 0 top
C3  46.09,64.08 90 top
C4  49.62,69.07 270 top
C5  41.84,69.65 270 top
C6  17.86,21.61 90 top
C7  57.67,58.69 180 top
C8  58.18,47.77 90 top
C9  56.91,47.77 90 top
C10  63.9,30.24 180 top
C11  35,55.65 0 top
C12  60.47,32.02 90 top
C13  49.78,38.78 0 top
C14  42.23,46 270 top
C15  24.13,45.57 180 top
C16  20.21,59.98 90 top
C17  20.3,22.8 0 top
C18  31.5,16.84 0 top
C19  29.35,21.44 90 top
C20  31.83,22.73 0 top
J1  38.37,37.61 270 bottom
JP1  21,51 270 top
JP2  54.12,45.99 90 bottom
JP3  24.91,59.45 270 bottom
L1  23.59,20.23 270 top
L2  35.53,20.31 270 top
L3  27.7,46.24 0 top
L4  60.29,46.8 90 top
LED1_Y  44.21,1.79 90 bottom
LED2_R  47.77,1.79 90 bottom
LED3_G  45.99,1.79 90 bottom
MOSFET1  31.77,46.5 90 top
MP1  35,54 0 top
MP2  35,65 180 top
MP3  35,7 0 top
PCB1  52,26 90 top
R1  67.7,44.18 180 top
R2  48.26,64.02 0 top
R3  48.25,65.19 0 top
R4  42.33,62.25 90 top
R5  43.25,20.02 90 top
R6  42.65,25.32 0 top
R7  42.67,23.26 0 top
R8  43.2,27.65 90 top
R9  34.31,46.5 270 top
R11  22.24,62.4 180 top
S1  68.5,49.75 270 bottom
TP1_UC_RESET  68.34,45.99 0 top
TP2_BT_RESET  43.66,21.82 0 top
U1  49.56,46.14 0 top
U2  45.63,68.79 0 top
U3  34.62,44.67 90 top
U4  56.25,56.51 0 top
U5  35,54 0 top
U6  22.5,58.65 0 top
U7  20.97,20.25 270 top
U8  33,20.24 270 top
U$1  39.64,36.85 0 bottom
U$2  39.64,35.58 0 bottom
U$3  37.1,35.58 0 bottom
U$4  39.64,33.8 0 bottom
W1  54.15,58.65 180 top
XTAL1  52.46,57.79 270 top

### Tracks (layer width: path | path; a pad name or v marks a point on that pad's centre or on a via)
1.0V  (via drill 0.38)
  Top 0.254: v50.31,55.13 47.77,57.67 v44.72,57.67 | v42.69,57.42 42.69,53.86 40.66,51.83 39.64,51.83 38.37,50.56 29.73,50.56 29.23,50.05 27.19,50.05 25.49,51.76 24.96,51.76 22.79,51.75 JP1.P$5 21.23,51.75 | U1.P$36 51.96,52.46 52.85,53.36 v52.85,53.81 | JP1.P$7 21.29,50.75 | U8.PIN3 32.35,21.23 32.27,21.3 | U7.PIN1 21.66,21.16 21.81,21.3 22.12,21.3 22.14,21.32
  Top 0.305: 20.97,51.76 21.23,51.75 | 21.23,50.69 21.29,50.75
  Top 0.406: 21.88,21.57 22.01,21.57 | C17.1 19.74,22.51 19.74,21.73 U7.PIN3 | 31.82,21.3 32.27,21.3 32.34,21.3
  Top 0.813: 22.19,21.38 22.14,21.32 | 22.01,21.57 22.19,21.38 | 22.19,21.38 23.57,21.38 L1.P$1 25.07,22.84 C19.A 30.88,22.84 C20.1 | v9.67,20.08 12.65,23.07 17.8,23.07 C6.A 18.06,22.8 C17.1 19.65,23 19.65,23.59 20.13,24.07 | v20.08,25.67 20.34,25.42 20.34,24.27 20.13,24.07 | 20.97,51.76 20.51,51.76 v20.08,51.32 20.72,50.69 21.23,50.69 | 21.81,21.3 22.62,22.11 22.62,23.49 22.04,24.07 20.13,24.07 | C20.1 30.98,22.13 31.82,21.3 | L2.P$1 35.52,23 34.56,23.97 31.51,23.97 31.03,23.49 31.03,22.77 C20.1
  Bottom 0.254: v52.85,53.81 51.83,55.13 v50.31,55.13 | v44.72,57.67 42.94,57.67 v42.69,57.42
  Bottom 0.813: v9.67,20.08 4.32,20.08 BT1.P$1 3.06,22.45 AUX_BATT.1 | v20.08,25.67 v20.08,51.32
3.3V  (via drill 0.38)  (1 unrouted)
  Top 0.254: 19.77,19.21 19.78,19.2 | U6.P$6 U6.P$7 | U6.P$6 U6.P$5 23.76,60.85 v26.64,57.98 | U6.P$6 22.82,62.33 R11.1 | 58.32,57.56 C7.1 | 58.32,57.56 U4.P$8 | C5.1 42.25,70.3 42.69,69.87 43.6,69.87 U2.6 43.63,68.89 U2.7 | U2.7 46.56,68.79 46.75,68.6 46.75,67.77 | 46.75,67.77 U2.12 | C4.1 47.79,69.72 U2.1 47.77,70.03 v47.77,71.14 | U2.7 43.52,68.8 | 45.92,65.93 C3.A | MOSFET1.2 34.01,47.45 R9.1 | 58.32,57.56 57.31,57.56 56.66,56.91 56.66,54.88 56.4,54.63 51.83,54.63 51.03,53.83 C1.1 50.36,52.57 U1.P$38 | 46.75,67.77 46.78,66.15 C3.A | v31.77,52.34 31.51,52.09 29.73,52.09 28.57,53.25 JP1.P$2 | C3.A 46.38,65.17 R3.1 47.6,64.32 R2.1 | 49.56,42.17 49.57,42.16 | L4.P$1 58.12,45.68 57.4,44.95 57.4,40.86 v56.61,40.07 | v56.43,37.96 56.07,38.32 55.39,38.32 54.63,37.56 50.03,37.56 49.13,38.46 C13.1 | v55.39,51.07 54.5,51.07 53.97,50.54 v50.36,50.54 v50.36,50.53 | R1.2 65.77,44.18 v65.29,43.7
  Top 0.305: v46.75,44.21 47.51,44.21 49.56,42.17 U1.P$17 49.56,39.21 C13.1 | 46.75,47.51 46.18,46.94 U1.P$5 42.52,46.94 C14.1 | v50.36,50.53 U1.P$38 | v32.02,55.64 32.07,55.64 C11.1 34.35,54.8 U5.VDD
  Top 0.406: U7.PIN4 19.91,19.36 19.77,19.21
  Top 0.813: C2.1 17.98,17.41 19.77,19.21 | C2.1 17.82,17.01 | C2.1 | v44.34,65.93 45.92,65.93 | 18.05,16.94 18.05,14.75 v18.81,13.99 | v46.75,44.21 46.75,47.51 v46.75,50.33 | MOSFET1.2 32.29,48.02 v31,48.02
  Bottom 0.254: v44.34,65.93 44.34,66.6 U2.1 47.63,70.99 v47.77,71.14 | 28.06,57.67 JP3.P$4 27.02,57.57 26.64,57.95 v26.64,57.98 | 33.04,51.83 32.27,51.83 v31.77,52.34 | v46.75,50.33 47.08,50.66 50.31,50.66 50.36,50.71 v50.36,50.53 | JP2.P$4 55.24,49.12 55.24,50.92 v55.39,51.07 | JP2.P$7 52.87,42.2 52.37,41.7 51.09,41.7 50.84,41.95 50.84,42.46 49.09,44.21 v46.75,44.21 | v56.43,37.96 56.61,38.14 v56.61,40.07 56.68,40.15 64.02,40.15 65.29,41.42 v65.29,43.7 | J1.2 32.53,36.34
  Bottom 0.813: v18.81,13.99 23.64,13.99 26.18,16.53 26.18,24.15 32.53,30.5 32.53,36.34 32.53,42.69 | v46.75,50.33 46.75,63.52 v44.34,65.93 | 32.53,42.69 31,44.21 v31,48.02 31,49.8 33.04,51.83 33.04,54.63 v32.02,55.64 30.09,57.58 JP3.P$4 | v46.75,44.21 46.24,44.21 46.24,43.2 44.72,41.67 38.62,41.67 37.61,42.69 32.53,42.69
ACL_WAKE  (via drill 0.38)
  Top 0.254: U1.P$42 47.16,52.74 47.11,52.74 43.7,56.15 v43.7,58.94 | U2.8 43.63,66.49 43.45,66.31 43.45,61.74 v43.7,61.48 42.44,61.48 R4.1
  Bottom 0.254: v43.7,58.94 v43.7,61.48
AREF
  Top 0.305: U1.P$29 56.73,46.94 C9.1
AVCC
  Top 0.254: C8.1 58.7,47.12 59.48,47.9 60.26,47.9 L4.P$2
  Top 0.305: U1.P$27 56.77,45.34 57.93,46.5 57.93,46.86 C8.1
BLINK  (via drill 0.38)  (1 unrouted)
  Top 0.254: R8.2 43.65,28.76 43.65,30.77 43.09,31.33 43.09,33.04 v42.79,33.34 | v45.79,36.52 45.99,37.08 57.14,37.08 63.52,43.45 63.52,49.29 59.96,52.85 59.96,53.61 | U1.P$35 52.76,52.53 53.23,53 53.25,53 v54.12,53.86
  Bottom 0.254: v42.79,33.34 45.66,36.13 v45.79,36.52 | v54.12,53.86 54.37,54.12 59.55,54.12 v60.01,53.66
BT_PWR  (via drill 0.38)  (1 unrouted)
  Top 0.254: U8.PIN4 32.04,19.34 31.77,19.07
  Top 0.305: PCB1.11 58.85,31.15
  Top 0.406: 31.77,19.07 32.23,19.07
  Top 0.813: 31.77,19.07 30,17.3 C18.1 30,15.75 v31.51,14.24 | v60.47,29.99 v60.48,30 | 61.36,30.24 C10.A | 61.36,30.24 61.36,30.27 | PCB1.11 60.47,31.4 C12.1 60.47,30.24 61.36,30.24
  Bottom 0.813: v31.51,14.24 37.35,14.24 39.39,16.27 39.39,24.65 43.7,28.97 43.7,33.04 45.23,34.56 58.44,34.56 60.47,32.53 v60.47,29.99
BT_PWR_CTL  (via drill 0.38)
  Top 0.254: U1.P$13 46.36,39.27 v46.19,39.13 | v34.18,22.7 34.13,22.7 33.65,22.22 U8.PIN1
  Bottom 0.254: 45.74,39.13 v46.19,39.13 45.23,39.13 44.47,38.37 44.47,37.61 42.43,35.58 42.43,34.31 41.93,33.8 41.93,32.78 42.43,32.27 42.43,28.97 38.37,24.91 38.37,23.38 37.73,22.75 v34.18,22.7
BT_SET_BAUD  (via drill 0.38)
  Top 0.254: U1.P$16 48.76,41.64 v48.78,41.77 | v59.96,23.38 59.71,23.13 58.6,23.13 PCB1.4
  Bottom 0.254: v48.78,41.77 48.78,40.4 53.86,35.32 58.94,35.32 63.52,30.75 63.52,29.48 59.96,25.92 v59.96,23.38
CONNECTED  (via drill 0.38)
  Top 0.254: 44.21,25.4 43.38,25.4 R6.2 | 44.21,25.4 PCB1.19 | U1.P$14 47.16,39.24 v47.26,39.13 | v43.35,35.09 43.65,34.79 43.65,31.56 44.21,31 44.21,25.4
  Bottom 0.254: v47.26,39.13 46.5,38.37 45.81,38.37 45.1,37.56 45.05,36.54 v43.35,35.09
DATA_TX/RX
  Top 0.254: PCB1.31 53.9,36.05
FACTORY_RESET
  Top 0.254: PCB1.22 43.68,21.8 TP2_BT_RESET.P$1 43.25,21.42 R5.2
GND  (via drill 0.38)  (7 unrouted)
  Top 0.254: U4.P$3 U4.P$4 | 42.18,45.23 42.18,45.48 42.69,45.99 43.2,45.99 43.45,46.24 | W1.PAD 54.94,59.44 v55.63,59.44 | 50.43,40.37 U1.P$18 | 22.22,51.25 23.08,51.25 v23.91,50.92 | JP1.P$10 v21.2,49.25 | JP1.P$3 23.63,52.75 v23.63,52.5
  Top 0.305: U1.P$39 49.56,52.92 C1.2 | C13.2 50.43,40.37
  Top 0.406: 20.98,19.2 C2.2 | 20.97,20.26 23.53,20.26 19.47,20.26 19.37,20.26 19.37,20.2 C6.C 17.54,20.52 | 20.97,20.26 20.97,21.25 | 20.97,20.26 20.97,20.25 | 20.97,19.19 20.97,20.25 | 20.97,20.25 | 33.01,20.23 33,18.01 | 33.01,20.23 34.66,20.23 29.77,20.21 C19.C | 33.01,21.15 33.01,20.23 | 20.97,21.32 20.97,22.62 C17.2 | U8.PIN2 33,22.41 C20.2
  Bottom 0.254: LED2_R.P$1 LED3_G.P$1 LED1_Y.P$1 40.95,0.99 40.91,1.03
  other vias: 19.74,56.44 44.82,71.22 54.92,25.87 44.72,63.92 19.75,64.06 51.23,22.49 58.91,49.67 42.36,44.28 26.47,27.76 27.72,14.36 63.51,26.54 4.4,14.43 56.14,17.7 66.12,59.69 64.98,51.16 24.71,9.15 63.32,53.9 50.59,67.44 52.64,62.13 31.71,26.57 30.2,31.3 42.09,58.59 52.85,18.92 35.12,29.74 60.69,17.7 36.21,26.65 54.06,30.42 18,27.21 25.39,61.95 47.83,66.5 50.68,27.39 35.52,16.53 45.42,45.84 65.69,55.73 63.41,58.95 47.54,42.06 68.5,52.9 24.77,58.42 23.55,16.56 30.67,42.21 26.6,43.74 22.03,42.21 58.72,42.06 55.4,53.35 32.8,58.21 60.21,37.23 28.2,34.95 37.63,49.32 35.59,45.54 43.62,54.78 49.2,57.83 48.44,49.19 45.39,49.95 49.74,20.34 55.58,22.12 40.47,16.46 49.75,30.92 48.48,24.32 31.21,35.36 25.88,32.82 63.21,34.73 68.54,29.91 48.44,55.03 68.53,47.73 63.7,41.63 13.53,16.26 40.98,1.47 36.92,55.8 38.44,52.5 34.88,52.25 10.38,23.4 39.15,43.25 38.49,38.83 35.85,37.67 40.99,35.31 35.66,33.78 40.48,30.48
  pour Top (isolate 0.305, rank 2): 0.02,72.15 70.37,72.15 70.37,15.76 49.8,15.76 49.8,18.05 47.77,18.05 47.77,15.76 42.43,15.76 42.43,0.02 0.02,0.02
  pour Bottom (isolate 0.305, rank 2): 0.02,72.15 70.12,72.15 70.37,15.76 49.8,15.76 49.8,18.05 47.77,18.05 47.77,15.76 42.43,15.76 42.43,0.02 0.02,0.27
GPS_TIME_REQ  (via drill 0.38)
  Top 0.254: U1.P$41 47.96,52.66 45.23,55.39 v45.23,55.72 | v44.72,53.86 44.72,53.61 43.96,52.85 42.43,52.85 40.91,51.32 39.89,51.32 38.62,50.05 29.99,50.05 29.33,49.44 23.11,49.44 22.9,49.75 JP1.P$9
  Bottom 0.254: v44.72,53.86 45.23,54.37 v45.23,55.72
GUARD_RING  (1 unrouted)
  Top 0.254: 53.13,56.41 51.45,56.41 51.45,59.15 51.48,59.17 53.41,59.17 53.38,59.12 53.48,59.12 53.48,58.82 53.61,58.69 54.12,58.69 W1._VIA
  Bottom 0.254: 54.14,58.61 54.14,57.78
  pour Bottom (isolate 0.305): 54.73,55.8 54.73,56.33 51.4,56.33 51.4,59.17 53.55,59.15 53.49,58.05 56.15,58.07 56.15,55.23 53.08,55.21 53.08,55.8
I2C_SCL  (via drill 0.38)  (1 unrouted)
  Top 0.254: U2.14 48.41,68.79 48.63,68.57 48.63,67.63 49.67,66.59 50.13,66.59 51.35,65.34 v51.35,63.72 51.17,63.62 49.04,61.41 49.04,60.47 | 49.04,60.47 49.04,60.21 48.53,59.71 47.77,59.71 47.51,59.96 41.67,59.96 39.39,57.67 v39.39,56.91 39.39,56.15 36.59,53.35 U5.SCL | U1.P$19 51.16,39.55 52.59,38.12 54.37,38.12 55.13,38.88 58.18,38.88 63.01,43.7 63.01,49.04 58.94,53.1 58.94,54.37 59.27,54.7 60.21,54.7 60.65,55.13 60.72,55.13 60.72,55.9 60.15,56.47 59.71,56.47 | 58.44,56.15 U4.P$6 59.42,56.18 59.71,56.47 | 59.71,56.47 59.71,59.45 58.69,60.47 49.04,60.47 | 22.17,53.78 22.17,55.13 | 22.17,55.13 U6.P$2 | v37.35,57.93 37.35,57.42 37.1,57.17 29.99,57.17 27.96,55.13 22.17,55.13 | R3.2 49.65,65.17 v50,64.79
  Bottom 0.254: v39.39,56.91 38.37,56.91 v37.35,57.93 | v50,64.79 51.07,63.72 v51.35,63.72
I2C_SDA  (via drill 0.38)  (1 unrouted)
  Top 0.254: U1.P$20 51.96,39.52 52.85,38.62 54.12,38.62 54.88,39.39 57.93,39.39 62.5,43.96 62.5,48.78 58.4,52.88 U4.P$5 58.41,55.54 v59.96,55.54 | v48.02,60.47 48.28,60.47 | v60.47,57.17 60.21,57.42 60.21,59.71 58.94,60.98 50.18,60.98 v49.9,61.26 | 38.28,57.53 37.35,56.66 30.22,56.66 27.45,53.89 23.61,53.89 v23.38,54.12 | 38.28,57.53 41.42,60.47 v48.02,60.47 | v48.02,60.47 48.4,60.85 48.4,61.61 48.91,62.14 48.91,63.62 R2.2 50.46,64.02 50.84,64.41 50.84,65.04 49.88,66 49.31,66 U2.13 | U6.P$1 21.52,54.29 21.1,53.86 | 21.1,53.86 21.1,52.85 21.58,52.24 22.14,52.26 | v20.34,53.61 20.84,53.61 21.1,53.86 | U5.SDA 37.12,54.65 38.62,56.15 38.62,57.19 38.28,57.53
  Bottom 0.254: v60.47,57.17 60.47,56.05 v59.96,55.54 | v49.9,61.26 48.78,61.23 v48.02,60.47 | v23.38,54.12 20.84,54.12 v20.34,53.61
JTAG_TCK  (via drill 0.38)
  Top 0.254: U1.P$21 52.76,39.48 53.1,39.13 53.86,39.13 55.13,40.4 55.64,40.4 v56.4,41.16
  Bottom 0.254: v56.4,41.16 56.62,41.38 JP2.P$1
JTAG_TDI  (via drill 0.38)
  Top 0.254: U1.P$24 54.6,42.94 53.94,43.6 v50.74,43.6
  Bottom 0.254: JP2.P$9 51.01,43.6 v50.74,43.6
JTAG_TDO  (via drill 0.38)
  Top 0.254: U1.P$23 55.13,42.02 55.13,41.67 v55.06,41.19
  Bottom 0.254: v55.06,41.19 55.37,41.91 JP2.P$3
JTAG_TMS  (via drill 0.38)
  Top 0.254: v53.94,41.67 53.56,41.29 U1.P$22
  Bottom 0.254: JP2.P$5 54.12,41.85 v53.94,41.67
N$1  (via drill 0.38)
  Top 0.254: R8.1 42.45,26.25 41.47,26.25 41.22,26 41.22,25.34 40.6,24.73 40.6,17.57 41.14,17.01 41.14,15.87 40.02,14.72 40.02,14.37 v40,14.34
  Bottom 0.254: LED1_Y.P$2 44.21,3.72 42.46,5.45 42.46,10.07 40,12.54 v40,14.34
N$2
  Top 0.406: U7.PIN6 21.97,19.36 22.16,19.16
  Top 0.813: 22.16,19.16 22.19,19.13 23.57,19.13 L1.P$2
N$3  (via drill 0.38)
  Top 0.254: U3.4 25.32,39.03 v25.42,39.13 | C15.1 25.16,45.95 v25.16,46.75 25.67,46.24 L3.P$1
  Bottom 0.254: v25.42,39.13 25.42,46.5 v25.16,46.75
N$4
  Top 0.254: L3.P$2 30.41,46.24 MOSFET1.3
N$5
  Top 0.254: PCB1.16 PCB1.15
N$7  (via drill 0.38)
  Top 0.254: R7.1 42.18,23.09 41.7,22.61 41.7,18.05 42.23,17.52 42.23,15.33 41.8,14.9 v41.8,14.52
  Bottom 0.254: LED2_R.P$2 46.92,3.45 45.99,3.45 43.5,5.93 43.5,10.51 41.8,12.21 v41.8,14.52
N$8  (via drill 0.38)
  Top 0.254: R6.1 41.16,24.48 41.16,17.8 41.72,17.24 41.72,15.64 40.94,14.85 v40.94,13.83
  Bottom 0.254: LED3_G.P$2 45.99,2.68 42.97,5.73 42.97,10.3 40.94,12.34 v40.94,13.83
N$11
  Top 0.254: R11.2 21.52,62.33 U6.P$8 20.43,60.85 C16.2
N$12
  Top 0.406: 34.05,19.07 33.78,19.32 33.76,19.34 U8.PIN6
  Top 0.813: 34.05,19.07 35.41,19.07 L2.P$2
N$13
  Top 0.254: XTAL1.P$1 52.77,58.51 53.8,57.48 U4.P$1
N$14
  Top 0.254: XTAL1.P$2 52.69,56.83 U4.P$2
PGM_MISO
  Bottom 0.254: U$1.2 J1.1
PGM_MOSI
  Bottom 0.254: U$3.2 J1.4
PGM_RESET
  Bottom 0.254: U$4.2 J1.5
PGM_SCK
  Bottom 0.254: U$2.2 J1.3
RTC_WAKE
  Top 0.254: U4.P$7 57.42,56.83 57.27,56.68 57.27,53.46 56.4,52.59 54.12,52.59 53.56,52.03 U1.P$34
SD_PWR_CTL
  Top 0.254: MOSFET1.1 34.01,45.55 R9.2 34.31,45.23 34.81,44.72 36.59,44.72 38.12,46.24 38.12,48.78 40.15,50.82 41.16,50.82 42.69,52.34 44.21,52.34 44.97,53.1 45.99,53.1 46.5,52.59 46.5,51.98 U1.P$43
SPI_CS  (via drill 0.38)
  Top 0.254: U1.P$44 44.53,51.83 42.94,51.83 41.42,50.31 40.4,50.31 38.62,48.53 38.62,45.99 36.85,44.21 28.97,44.21 v27.7,42.94 | U3.2 26.42,36.83 v26.94,37.35
  Bottom 0.254: v26.94,37.35 26.94,42.18 v27.7,42.94
SPI_SCK  (via drill 0.38)
  Top 0.254: U3.5 23.93,40.15 26.69,40.15 27.19,39.64 39.39,39.64 40.15,40.4 | 40.15,40.4 40.15,47.77 41.16,48.78 42.43,48.78 42.69,48.53 43.2,48.53 43.21,48.54 U1.P$3 | 40.15,40.4 41.42,39.13 41.42,37.1 v39.89,35.58
  Bottom 0.254: U$2.1 v39.89,35.58
SPI_SDI  (via drill 0.38)
  Top 0.254: U3.7 24.07,42.18 25.42,42.18 27.45,40.15 37.1,40.15 38.12,41.16 | U1.P$2 43.81,49.29 40.91,49.29 39.64,48.02 39.64,45.48 38.12,43.96 38.12,41.16 | v38.62,40.4 38.12,40.91 38.12,41.16
  Bottom 0.254: U$1.1 39.64,39.39 v38.62,40.4
SPI_SDO  (via drill 0.38)
  Top 0.254: U3.3 26.25,37.93 27.45,39.13 36.59,39.13 36.85,38.88 v36.85,38.62 36.85,37.1 36.34,36.59 36.34,36.08 v36.85,35.58 | U1.P$1 43.77,50.05 42.69,50.05 42.43,49.8 40.66,49.8 39.13,48.28 39.13,45.74 37.35,43.96 37.35,41.42 37.1,41.16 v36.85,41.16
  Bottom 0.254: v36.85,41.16 v36.85,38.62 | U$3.1 v36.85,35.58
STATUS_CONN=LOW
  Top 0.254: PCB1.21 45.14,23.26 R7.2
UART0_RX  (via drill 0.38)  (1 unrouted)
  Top 0.254: U1.P$9 42.72,43.74 42.43,43.45 v41.67,43.45 | 22.23,48.78 29.48,48.78 30.24,49.55 34.31,49.55 36.85,47.01 v37.1,47.01
  Bottom 0.254: v41.67,43.45 38.12,47.01 v37.1,47.01 36.85,47.26 36.85,52.7 31.18,58.36 31.18,58.69 29.66,60.21 29.66,60.65 28.98,61.33 JP3.P$1
UART0_TX  (via drill 0.38)
  Top 0.254: U1.P$10 42.86,42.94 v42.48,42.69 | v36.31,46.32 36.31,46.78 34.05,49.04 30.5,49.04 29.71,48.25 JP1.P$12
  Bottom 0.254: v42.48,42.69 42.15,42.69 41.42,42.69 40.91,43.15 40.91,43.45 38.04,46.32 v36.31,46.32 36.34,46.35 36.34,52.47 30.7,58.11 30.7,58.38 29.01,60.08 JP3.P$2 27.39,60.03
UART1_RX
  Top 0.254: U1.P$11 43.86,41.52 44.21,41.16 44.21,31.77 44.47,31.51 45.29,31.51 PCB1.14
UART1_TX
  Top 0.254: 45.56,32.76 PCB1.13 45.22,32.78 44.72,32.78 44.72,39.39 45.56,40.22 U1.P$12
UC_RESET  (via drill 0.38)
  Top 0.254: v45.15,47.74 43.96,47.77 43.93,47.74 U1.P$4 42.97,47.74 42.69,48.02 42.43,48.02 42.18,48.28 41.42,48.28 40.66,47.51 40.66,40.66 41.93,39.39 41.93,34.81 40.91,33.8 v40.15,33.8 | v68.85,42.94 68.85,43.68 R1.1 TP1_UC_RESET.P$1
  Bottom 0.254: v45.15,47.74 45.84,48.4 47.64,50.21 49.65,50.21 50.05,49.8 50.71,49.8 51.12,50.21 53.56,50.21 53.86,49.9 53.86,49.55 54.12,49.29 JP2.P$6 54.12,50.69 54.55,51.12 54.55,51.45 55.01,51.91 58.61,51.91 68.5,42.02 | 68.5,42.02 S1.P$2 | 68.5,42.02 68.5,42.59 v68.85,42.94 | U$4.1 v40.15,33.8

### Text on the board
tPlace: uC reset | Greenness | Logger V15 | main board | BT reset | rickshory.com
bPlace: R | hold | T | - | strong | + | magnet | here to | reset | <---